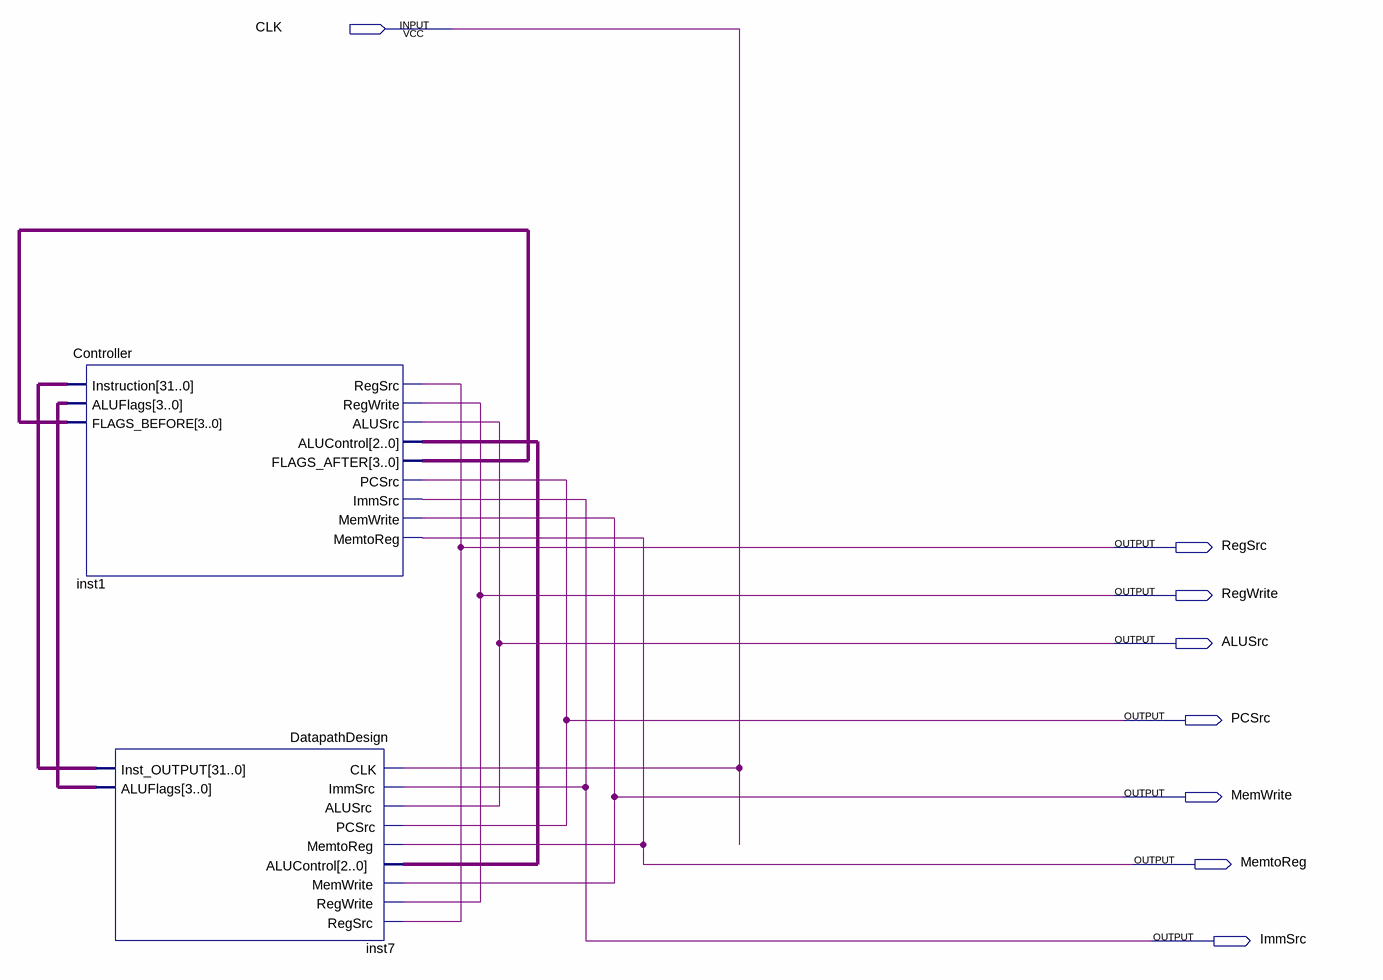
[diagram p0: schematic sheet]
// Quartus schematic SingleCycleProcessor.bdf as structural Verilog: 2 symbols, 8 pins
module SingleCycleProcessor (
  input  CLK,
  output RegSrc,
  output RegWrite,
  output ALUSrc,
  output PCSrc,
  output MemWrite,
  output MemtoReg,
  output ImmSrc
);

  wire [2:0] inst1_alucontrol;
  wire [3:0] inst1_flags_after, inst7_aluflags;
  wire [31:0] inst7_inst_output;

  Controller inst1 (
    .Instruction(inst7_inst_output), .ALUFlags(inst7_aluflags), .FLAGS_BEFORE(inst1_flags_after),
    .RegSrc(RegSrc), .RegWrite(RegWrite), .ALUSrc(ALUSrc), .ALUControl(inst1_alucontrol),
    .FLAGS_AFTER(inst1_flags_after), .PCSrc(PCSrc), .ImmSrc(ImmSrc), .MemWrite(MemWrite), .MemtoReg(MemtoReg));
  DatapathDesign inst7 (
    .CLK(CLK), .ImmSrc(ImmSrc), .ALUSrc(ALUSrc), .PCSrc(PCSrc), .MemtoReg(MemtoReg),
    .ALUControl(inst1_alucontrol), .MemWrite(MemWrite), .RegWrite(RegWrite), .RegSrc(RegSrc),
    .Inst_OUTPUT(inst7_inst_output), .ALUFlags(inst7_aluflags));
endmodule
